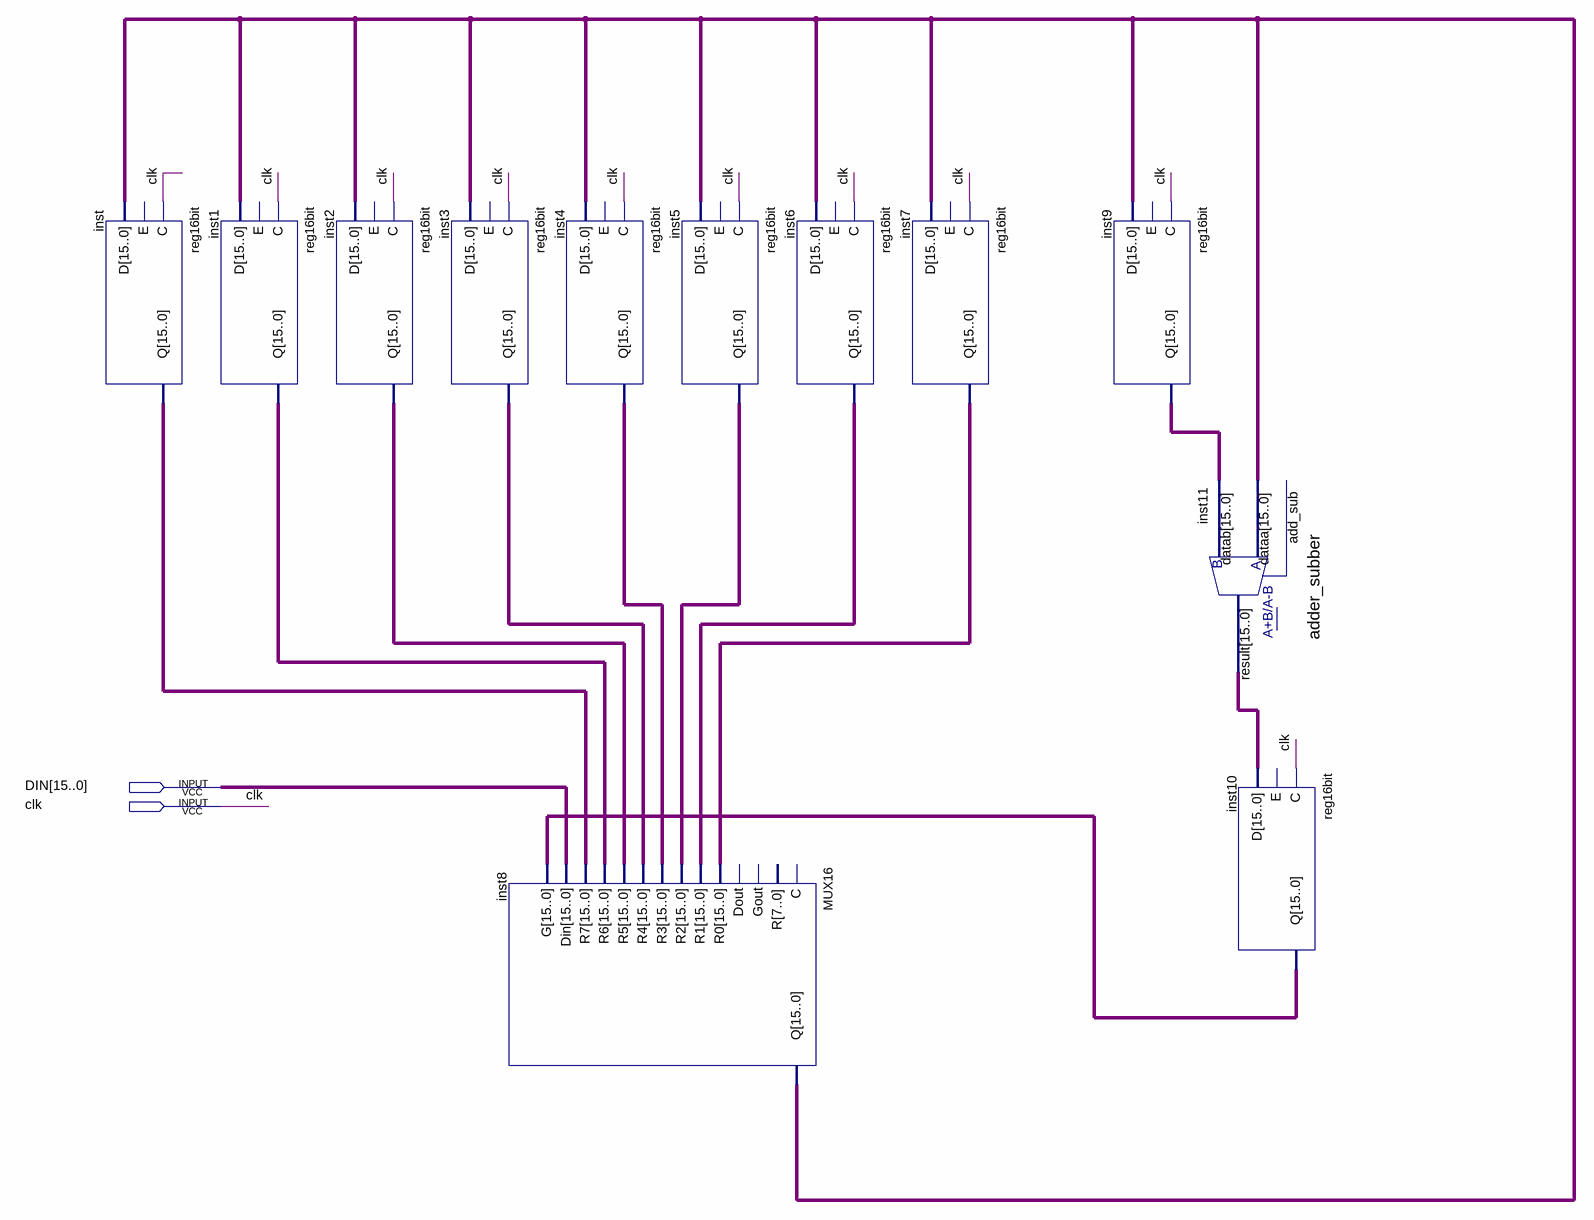
[diagram p0: schematic sheet]
// Quartus schematic CPUBlockDesign.bdf as structural Verilog: 12 symbols, 2 pins
module CPUBlockDesign (
  input  [15:0] DIN,
  input  clk
);

  wire [15:0] inst1_q, inst2_q, inst3_q, inst4_q, inst5_q, inst6_q, inst7_q, inst8_q, inst9_q, inst10_q,
       inst11_result, inst_q;

  reg16bit inst (.C(clk), .D(inst8_q), .Q(inst_q));  // open: E
  reg16bit inst1 (.C(clk), .D(inst8_q), .Q(inst1_q));  // open: E
  reg16bit inst2 (.C(clk), .D(inst8_q), .Q(inst2_q));  // open: E
  reg16bit inst3 (.C(clk), .D(inst8_q), .Q(inst3_q));  // open: E
  MUX16 inst8 (
    .R0(inst7_q), .R1(inst6_q), .R2(inst5_q), .R3(inst4_q), .R4(inst3_q), .R5(inst2_q), .R6(inst1_q),
    .R7(inst_q), .Din(DIN), .G(inst10_q), .Q(inst8_q));  // open: C, R, Gout, Dout
  reg16bit inst4 (.C(clk), .D(inst8_q), .Q(inst4_q));  // open: E
  reg16bit inst5 (.C(clk), .D(inst8_q), .Q(inst5_q));  // open: E
  reg16bit inst6 (.C(clk), .D(inst8_q), .Q(inst6_q));  // open: E
  reg16bit inst7 (.C(clk), .D(inst8_q), .Q(inst7_q));  // open: E
  reg16bit inst9 (.C(clk), .D(inst8_q), .Q(inst9_q));  // open: E
  adder_subber inst11 (.dataa(inst8_q), .datab(inst9_q), .result(inst11_result));  // open: add_sub
  reg16bit inst10 (.C(clk), .D(inst11_result), .Q(inst10_q));  // open: E
endmodule
